# EAGLE design motor_driver2 (EAGLE 6.2)
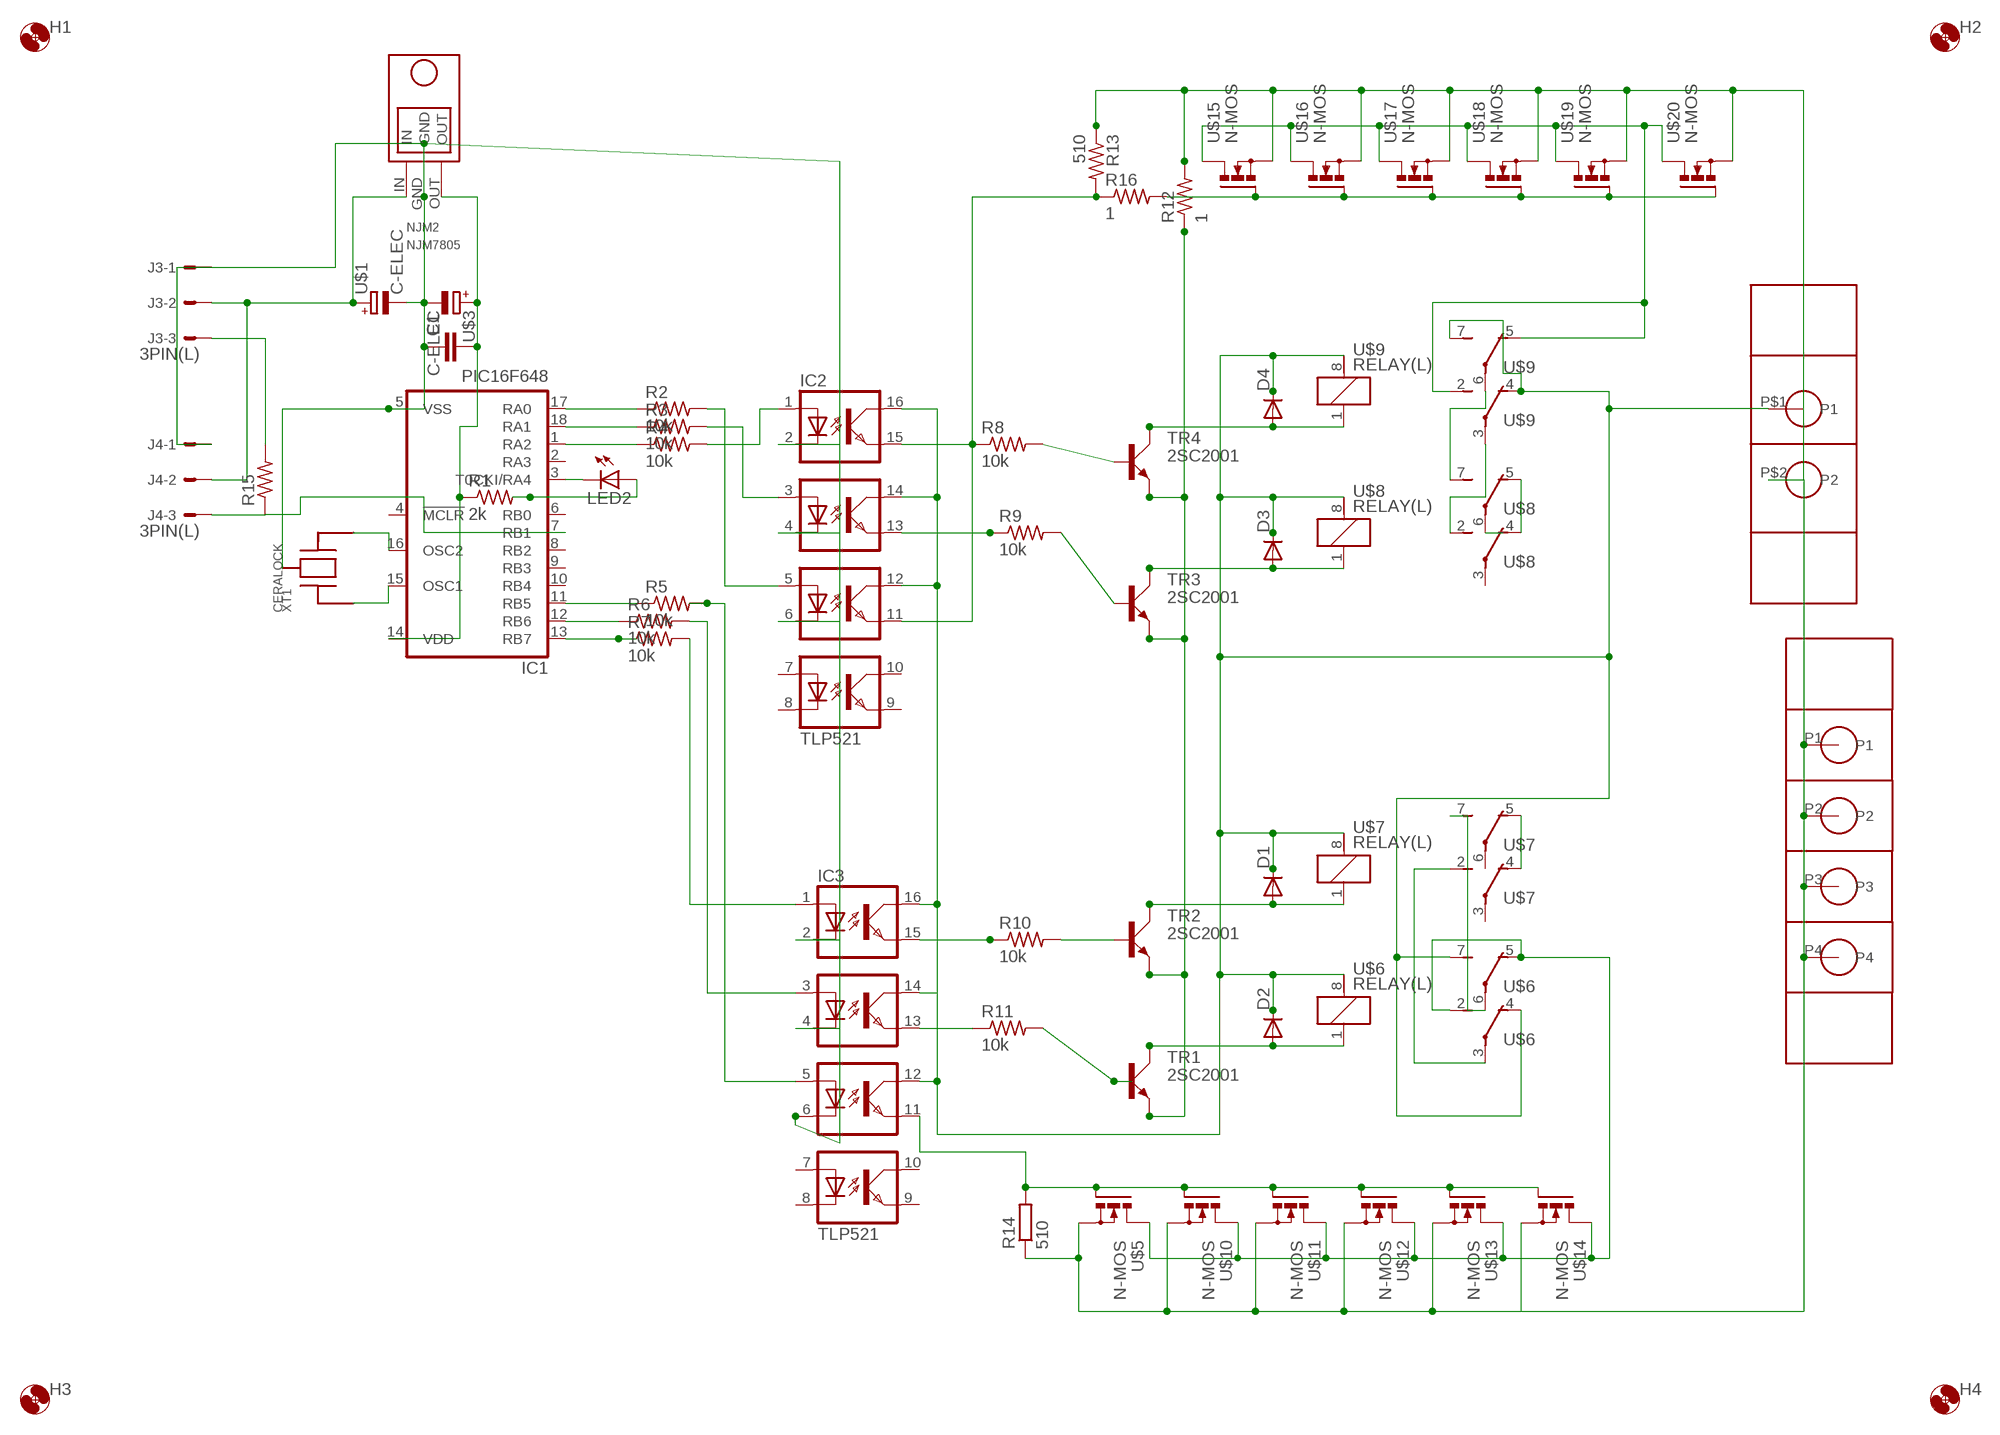
[diagram p0: schematic, sheet 1]

## Parts
C1  C-  [C-2.54]
D1  DIODE7.5  [DIODE7.5]
D2  DIODE7.5  [DIODE7.5]
D3  DIODE7.5  [DIODE7.5]
D4  DIODE7.5  [DIODE7.5]
H1  HOLE3.3M3BOLT  [HOLE3.3]
H2  HOLE3.3M3BOLT  [HOLE3.3]
H3  HOLE3.3M3BOLT  [HOLE3.3]
H4  HOLE3.3M3BOLT  [HOLE3.3]
IC1  PIC16F648  [DIL18]
IC2  TLP521  [DIL16]
IC3  TLP521  [DIL16]
J3  3PIN(L)  [3PL]
J4  3PIN(L)  [3PL]
LED2  LED-2  [LED5MM-2]
NJM2  NJM7805  [NJM7805]
R1  2k  R-  [0207/10]
R2  10k  R-  [0207/10]
R3  10k  R-  [0207/10]
R4  10k  R-  [0207/10]
R5  10k  R-  [0207/10]
R6  10k  R-  [0207/10]
R7  10k  R-  [0207/10]
R8  10k  R-  [0207/10]
R9  10k  R-  [0207/10]
R10  10k  R-  [0207/10]
R11  10k  R-  [0207/10]
R12  1  R-  [0207/10]
R13  510  R-  [0207/10]
R14  510  R-EU2R0207V  [R0207V]
R15  R-  [0207/10]
R16  1  R-  [0207/10]
TR1  2SC2001  [TO92BCE]
TR2  2SC2001  [TO92BCE]
TR3  2SC2001  [TO92BCE]
TR4  2SC2001  [TO92BCE]
U$1  C-ELEC  [C-6MM]
U$2  BP341L  [BP341L]
U$3  C-ELEC  [C-6MM]
U$4  BP341L_1  [BP341L]
U$5  N-MOS  [TO220BV]
U$6  RELAY(L)  [G2R2]
U$7  RELAY(L)  [G2R2]
U$8  RELAY(L)  [G2R2]
U$9  RELAY(L)  [G2R2]
U$10  N-MOS  [TO220BV]
U$11  N-MOS  [TO220BV]
U$12  N-MOS  [TO220BV]
U$13  N-MOS  [TO220BV]
U$14  N-MOS  [TO220BV]
U$15  N-MOS  [TO220BV]
U$16  N-MOS  [TO220BV]
U$17  N-MOS  [TO220BV]
U$18  N-MOS  [TO220BV]
U$19  N-MOS  [TO220BV]
U$20  N-MOS  [TO220BV]
XT1  CERALOCK  [CERALOCK]

## Nets
5V: C1.P$2 IC1.14(VDD) NJM2.OUT R1.1 U$3.+
9V: J3.2 J4.2 NJM2.IN U$1.+
12V: D1.PK(C) D2.PK(C) D3.PK(C) D4.PK(C) IC2.12(COL2) IC2.14(COL1) IC2.16(COL0) IC3.12(COL2) IC3.14(COL1) IC3.16(COL0) U$4.P$1(P1) U$6.4(R2:O) U$6.7(R1:S) U$6.8 U$7.8 U$8.8 U$9.4(R2:O) U$9.7(R1:S) U$9.8
FET_D1: U$9.2(R2:S) U$9.5(R1:O) U$15.D U$16.D U$17.D U$18.D U$19.D U$20.D
FET_G1: IC2.11(EMIT2) R13.2 R16.1
FET_G2: IC3.11(EMIT2) R14.2 U$5.G U$10.G U$11.G U$12.G U$13.G U$14.G
GND1: C1.P$1 IC1.5(VSS) IC2.2(C0) IC2.4(C1) IC2.6(C2) IC3.2(C0) IC3.4(C1) IC3.6(C2) J3.1 J4.1 NJM2.GND U$1.- U$3.- XT1.P2
GND2: R12.2 R13.1 R14.1 U$2.P1 U$2.P2 U$2.P3 U$2.P4 U$4.P$2(P2) U$5.S U$10.S U$11.S U$12.S U$13.S U$14.S U$15.S U$16.S U$17.S U$18.S U$19.S U$20.S
GND3: R12.1 TR1.E TR2.E TR3.E TR4.E
LED_A: LED2.A R1.2
LED_C: IC1.3(T0CKI/RA4) LED2.K(C)
N$1: IC1.16(OSC2) XT1.P3
N$2: J3.3 R15.2
N$3: R16.2 U$15.G U$16.G U$17.G U$18.G U$19.G U$20.G
N$7: IC1.15(OSC1) XT1.P1
N$10: IC1.17(RA0) R2.1
N$11: IC1.18(RA1) R3.1
N$12: IC1.1(RA2) R4.1
N$13: IC1.13(RB7) R7.1
N$14: IC1.12(RB6) R6.1
N$15: IC1.11(RB5) R5.1
N$16: IC2.5(A2) R2.2
N$17: IC2.3(A1) R3.2
N$18: IC2.1(A0) R4.2
N$19: IC3.1(A0) R7.2
N$20: IC3.3(A1) R6.2
N$21: IC3.5(A2) R5.2
N$23: IC2.15(EMIT0) R8.1
N$24: IC2.13(EMIT1) R9.1
N$25: IC3.15(EMIT0) R10.1
N$26: IC3.13(EMIT1) R11.1
N$27: R11.2 TR1.B
N$29: D4.PA(A) TR4.C U$9.1
N$30: D3.PA(A) TR3.C U$8.1
N$31: D1.PA(A) TR2.C U$7.1
N$32: D2.PA(A) TR1.C U$6.1
N$37: U$5.D U$6.2(R2:S) U$6.5(R1:O) U$10.D U$11.D U$12.D U$13.D U$14.D
N$40: U$8.7(R1:S) U$9.6(R1:P)
N$41: U$8.2(R2:S) U$9.3(R2:P)
N$42: U$8.4(R2:O) U$8.5(R1:O)
N$43: R8.2 TR4.B
N$44: R9.2 TR3.B
N$45: R10.2 TR2.B
N$47: U$8.6(R1:P)
N$50: U$6.6(R1:P) U$7.7(R1:S)
N$51: U$6.3(R2:P) U$7.2(R2:S)
N$53: U$7.4(R2:O) U$7.5(R1:O)
SIGNAL: IC1.7(RB1) J4.3 R15.1
Unconnected: IC1.2(RA3) IC1.4(!MCLR) IC1.6(RB0) IC1.8(RB2) IC1.9(RB3) IC1.10(RB4) IC2.7(A3) IC2.8(C3) IC2.9(EMIT3) IC2.10(COL3) IC3.7(A3) IC3.8(C3) IC3.9(EMIT3) IC3.10(COL3) U$7.3(R2:P) U$7.6(R1:P) U$8.3(R2:P)

## Library data of the parts
C1 = My_rcl:C-
D1-D4 = diode:DIODE7.5
H1-H4 = FP-21T for MITS:HOLE3.3
IC1 = FP-21T for MITS:PIC16F648
IC2 IC3 = FP-21T for MITS:TLP521
J3 J4 = my_connector:3PIN(L)
LED2 = my_led:LED-2
NJM2 = My_NJM7805:NJM7805
R1-R13 R15 R16 = My_rcl:R-: Resistor
R14 = FP-21T for MITS:R-EU2
TR1-TR4 = My_transistor:2SC2001: NPN Transistor
U$1 U$3 = My_rcl:C-ELEC
U$2 = BP341_4PIN:BP341L
U$4 = BP341L_1:BP341L_1
U$5 U$10-U$20 = FET_kai:N-MOS
U$6-U$9 = relay:RELAY(L)
XT1 = ceralock:CERALOCK

## Board
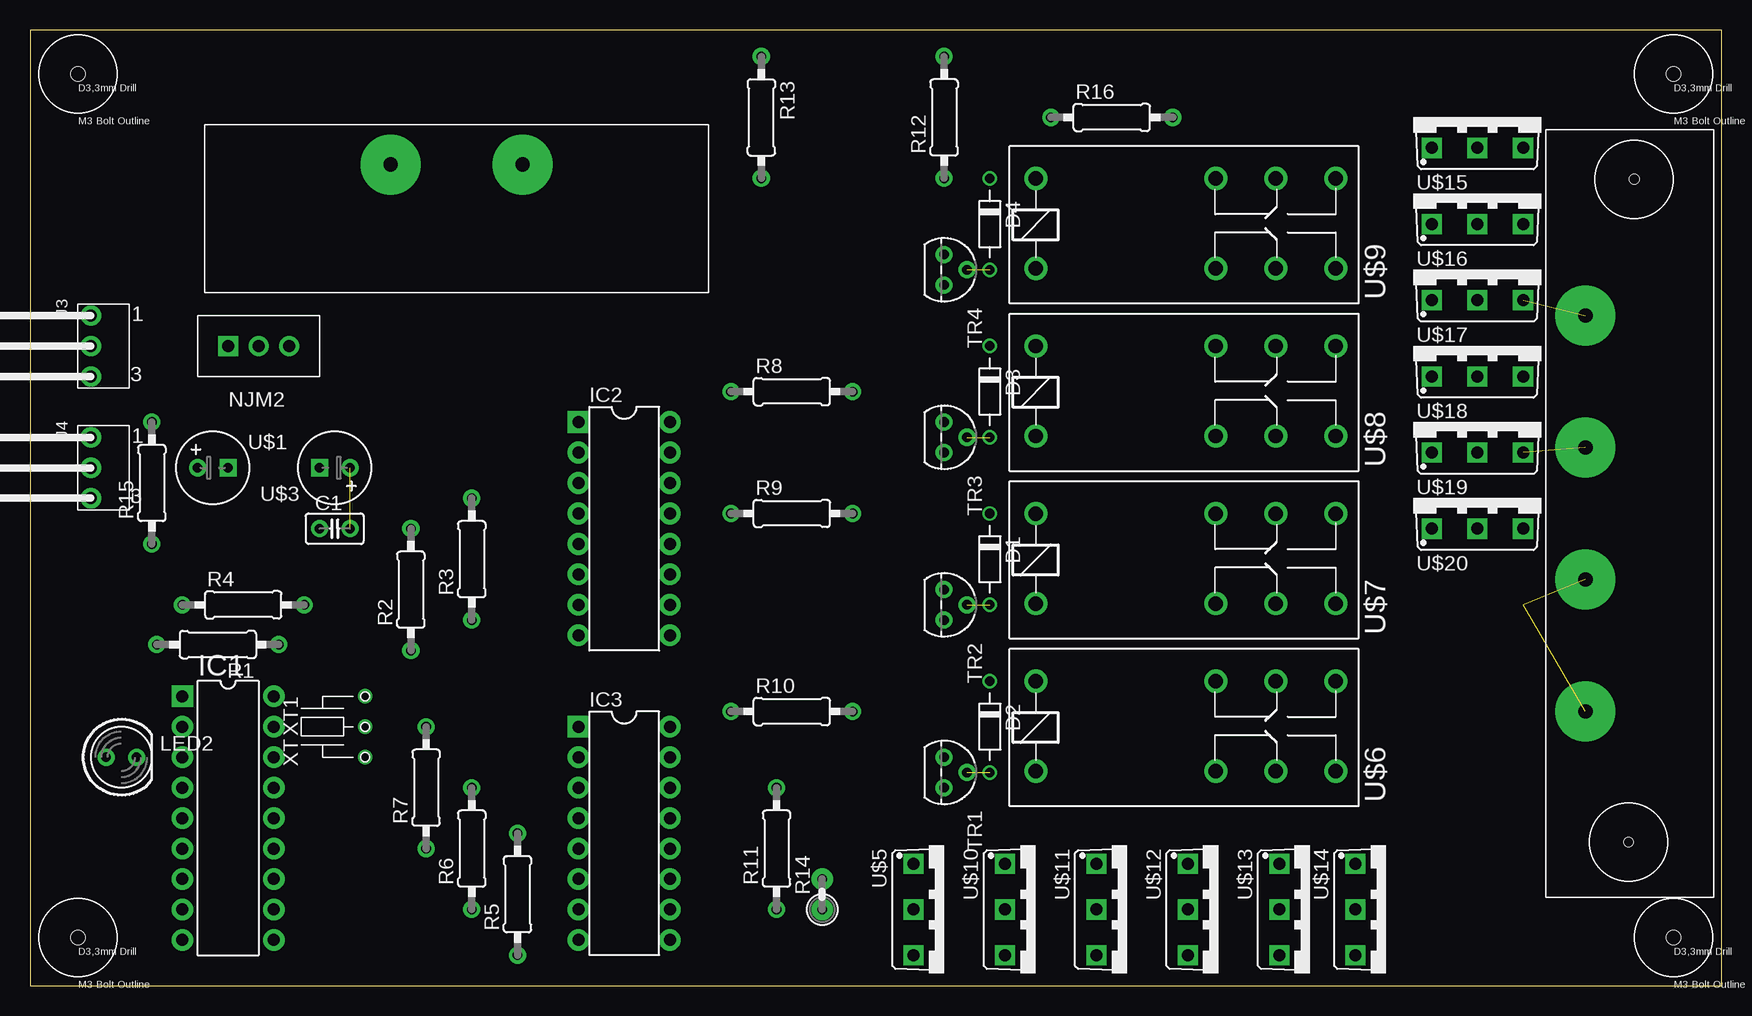
[diagram p1: board, top side]
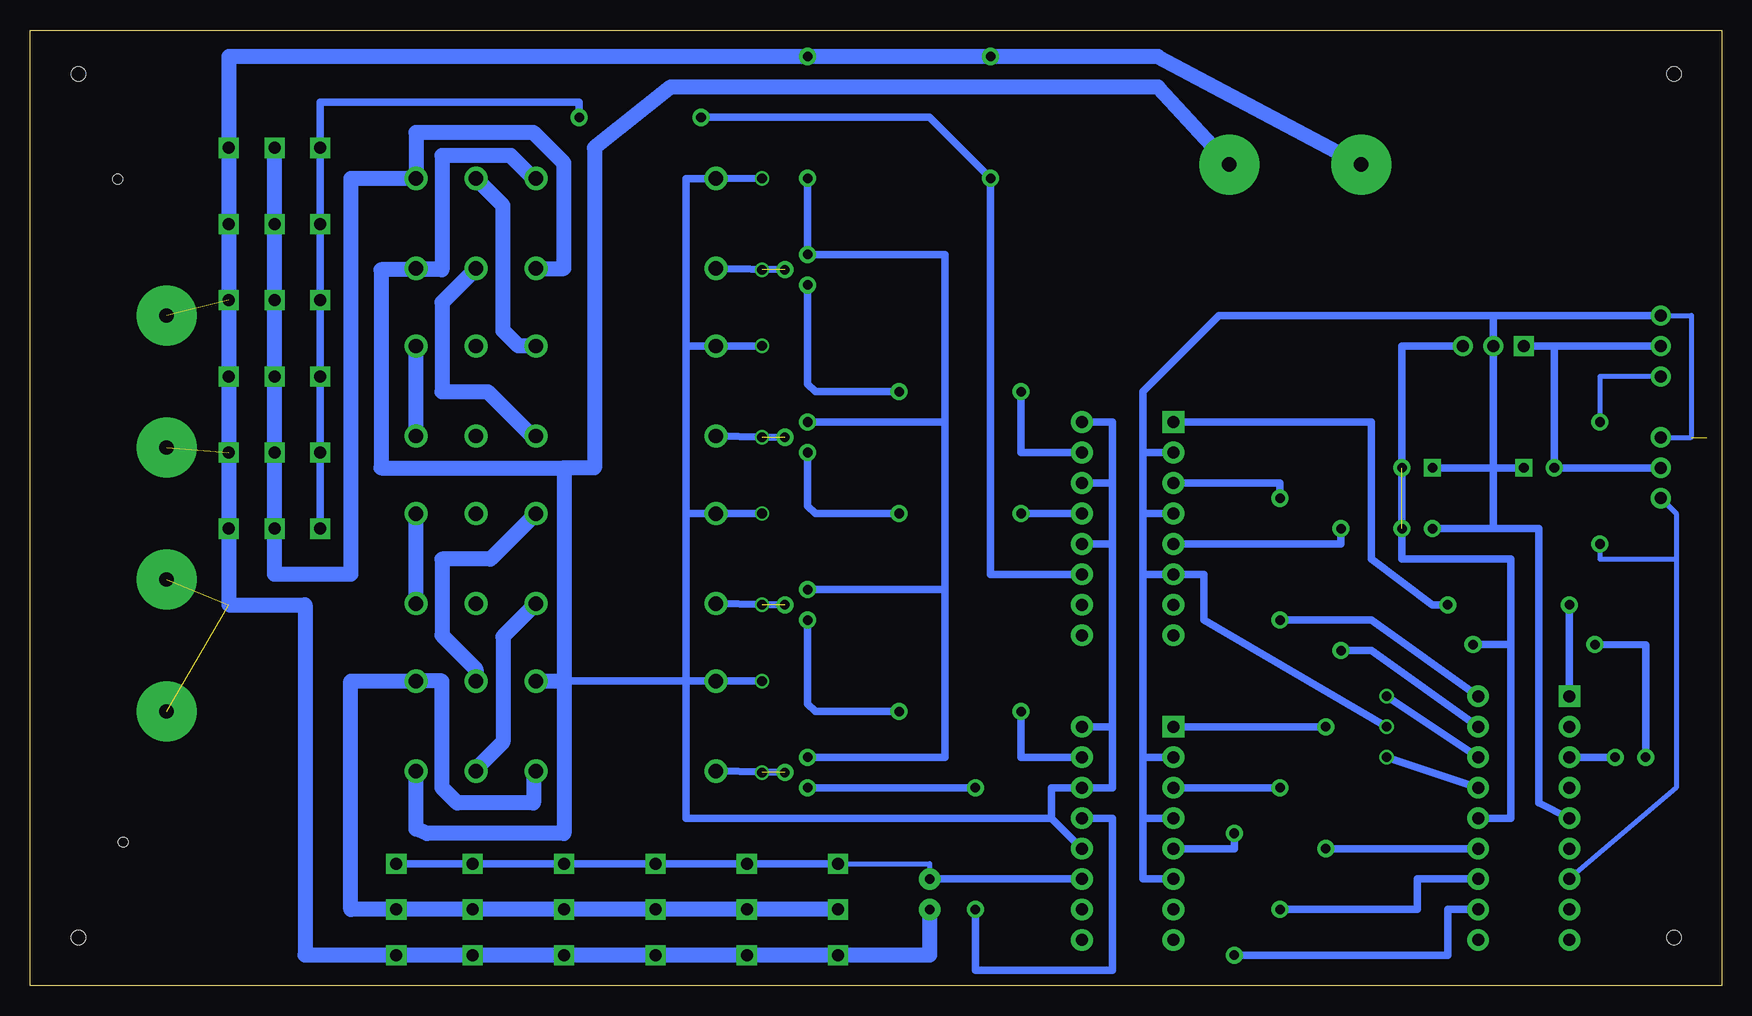
[diagram p2: board, bottom side, seen from below]

Size 141.03 x 79.68 mm. Coordinates in mm from the lower left corner, seen from the top.
Outline: 0,0 141.03,0 141.03,79.68 0,79.68 0,0
Copper layers (1*16): Top 0.035mm / dielectric 1.5mm / Bottom 0.035mm
Design rules: minimum track width 0.15mm, minimum drill 0.3mm, track to track 0.15mm, track to pad 0.15mm, pad to pad 0.15mm, via to via 0.15mm, smd to smd 0.15mm, copper to edge 0.7mm, drill to drill 0.45mm, minimum pad ring 0.15mm, minimum via ring 0.15mm, stop-mask expansion 4mil, vias tented up to drill 0mil, thermal gap 0.15mm

### Footprints (pad centres in the part's own frame; a part is rotated, then mirrored left to right if it is on the bottom)
C-2.54 = drill 0.8 pad 1.422: P$1 -1.27,0; P$2 1.27,0
DIODE7.5 = drill 0.8: PA 3.81,0; PK -3.81,0
HOLE3.3 = hole 1.2: 0,0
DIL18 = drill 1 pad 1.8 square: 1 -10.16,-3.81 | drill 1 pad 1.8: 2 -7.62,-3.81; 3 -5.08,-3.81; 4 -2.54,-3.81; 5 0,-3.81; 6 2.54,-3.81; 7 5.08,-3.81; 8 7.62,-3.81; 9 10.16,-3.81; 10 10.16,3.81; 11 7.62,3.81; 12 5.08,3.81; 13 2.54,3.81; 14 0,3.81; 15 -2.54,3.81; 16 -5.08,3.81; 17 -7.62,3.81; 18 -10.16,3.81
DIL16 = drill 1 pad 1.8 square: 1 -8.89,-3.81 | drill 1 pad 1.8: 2 -6.35,-3.81; 3 -3.81,-3.81; 4 -1.27,-3.81; 5 1.27,-3.81; 6 3.81,-3.81; 7 6.35,-3.81; 8 8.89,-3.81; 9 8.89,3.81; 10 6.35,3.81; 11 3.81,3.81; 12 1.27,3.81; 13 -1.27,3.81; 14 -3.81,3.81; 15 -6.35,3.81; 16 -8.89,3.81
3PL = drill 1 pad 1.676: 1 2.54,3.81; 2 0,3.81; 3 -2.54,3.81
LED5MM-2 = drill 0.8 pad 1.422: A -1.27,0; K 1.27,0
NJM7805 = drill 1 pad 1.676: GND 0,0; OUT 2.54,0 | drill 1 pad 1.676 square: IN -2.54,0
0207/10 = drill 0.8 pad 1.422: 1 -5.08,0; 2 5.08,0
R0207V = drill 0.8 pad 1.778: 1 -1.27,0; 2 1.27,0
TO92BCE = drill 0.8 pad 1.422: B 1.27,0; C 0,1.905; E -1.27,0
C-6MM = drill 0.8 pad 1.422: + -1.27,0 | drill 0.8 pad 1.422 square: - 1.27,0
BP341L = drill 1.2 pad 5: P1 -16.5,-3.7; P2 -5.5,-3.7; P3 5.5,-3.7; P4 16.5,-3.7 | hole 0.8: -27.87,0.37; 27.4,-0.1
BP341L' = drill 1.2 pad 5: P$1 -5.499,-3.698; P$2 5.499,-3.698
TO220BV = drill 1 pad 1.676 square: D 0,0; G -3.81,0; S 3.81,0
G2R2 = drill 1.2 pad 1.93: 1 -11.4,-3.7; 2 3.6,-3.7; 3 8.6,-3.7; 4 13.6,-3.7; 5 13.6,3.8; 6 8.6,3.8; 7 3.6,3.8; 8 -11.4,3.8
CERALOCK = drill 0.8: P1 -2.54,-3.81; P2 0,-3.81; P3 2.54,-3.81

### Placement (x,y rotation side)
C1  25.4,38.1 0 top
D1  80.01,35.56 270 top
D2  80.01,21.59 270 top
D3  80.01,49.53 270 top
D4  80.01,63.5 270 top
H1  137,4 0 top
H2  4,76 0 top
H3  4,4 0 top
H4  137,76 0 top
IC1  16.51,13.97 270 top
IC2  49.53,38.1 270 top
IC3  49.53,12.7 270 top
J3  8.89,53.34 90 top
J4  8.89,43.18 90 top
LED2  7.62,19.05 0 top
NJM2  19.05,53.34 0 top
R1  15.66,28.44 180 top
R2  31.75,33.02 90 top
R3  36.83,35.56 90 top
R4  17.78,31.75 0 top
R5  40.64,7.62 90 top
R6  36.83,11.43 90 top
R7  33.02,16.51 90 top
R8  63.5,49.53 0 top
R9  63.5,39.37 0 top
R10  63.5,22.86 0 top
R11  62.23,11.43 90 top
R12  76.2,72.39 90 top
R13  60.96,72.39 270 top
R14  66.04,7.62 90 top
R15  10.16,41.91 90 top
R16  90.17,72.39 0 top
TR1  76.2,17.78 270 top
TR2  76.2,31.75 270 top
TR3  76.2,45.72 270 top
TR4  76.2,59.69 270 top
U$1  15.24,43.18 0 top
U$2  133.35,39.37 270 top
U$3  25.4,43.18 180 top
U$4  BP341L_1  [BP341L']  35.56,64.77 180 top
U$5  73.66,6.35 270 top
U$6  95.25,21.59 0 top
U$7  95.25,35.56 0 top
U$8  95.25,49.53 0 top
U$9  95.25,63.5 0 top
U$10  81.28,6.35 270 top
U$11  88.9,6.35 270 top
U$12  96.52,6.35 270 top
U$13  104.14,6.35 270 top
U$14  110.49,6.35 270 top
U$15  120.65,69.85 0 top
U$16  120.65,63.5 0 top
U$17  120.65,57.15 0 top
U$18  120.65,50.8 0 top
U$19  120.65,44.45 0 top
U$20  120.65,38.1 0 top
XT1  24.13,21.59 90 top

### Tracks (layer width: path | path; a pad name or v marks a point on that pad's centre or on a via)
5V  (1 unrouted)
  Bottom 0.61: NJM2.OUT 26.67,53.34 C1.P$2 26.67,35.56 17.68,35.56 17.61,35.56 | 17.61,35.56 17.58,33.84 17.58,13.97 IC1.14 | R1.1 17.61,28.44 17.61,35.56
9V
  Bottom 0.61: J3.2 13.97,53.34 | 13.97,53.34 U$1.+ J4.2 | 13.97,53.34 NJM2.IN
12V
  Bottom 0.61: D4.PK U$9.8 86.36,67.3 86.36,53.34 U$8.8 | U$8.8 D3.PK | U$7.8 D1.PK | IC2.16 50.8,46.99 50.8,41.91 | IC2.14 50.8,41.91 | 50.8,41.91 50.8,36.83 | IC2.12 50.8,36.83 | 50.8,36.83 50.8,21.59 | 50.8,21.59 50.8,16.51 IC3.14 55.88,16.51 55.88,13.97 | IC3.16 50.8,21.59 | IC3.12 55.88,13.97 | U$8.8 86.36,53.33 86.36,39.37 U$7.8 | U$7.8 86.36,39.36 86.36,25.4 | 86.36,25.4 U$6.8 | U$6.8 D2.PK U$6.8 | 86.36,25.4 96.52,25.4 | 86.36,25.4 86.36,13.97 55.88,13.97
  Bottom 1.016: U$6.7 arc90 U$6.7
  Bottom 1.27: 106.68,59.8 106.68,69.22 100.97,69.22 99.05,67.3 U$9.7 | U$9.4 106.68,59.8 | 106.68,59.8 106.68,59.69 111.76,59.69 111.76,43.18 96.52,43.18 | 96.52,43.18 96.52,25.4 | U$6.7 96.52,25.4 | 96.52,25.4 96.52,12.7 107.95,12.7 108.85,13.07 U$6.4 | 96.52,43.18 93.98,43.18 93.98,69.85 87.63,74.93 46.99,74.93 U$4.P$1
FET_D1
  Bottom 1.27: U$9.2 96.52,59.8 96.52,68.58 99.06,71.12 108.85,71.12 U$9.5 114.3,67.3 114.3,34.29 120.65,34.29 U$20.D U$19.D U$18.D U$17.D U$16.D U$15.D
FET_G1
  Bottom 0.61: IC2.11 60.96,34.29 R13.2 66.04,72.39 R16.1
FET_G2
  Bottom 0.406: U$5.G 66.04,10.16 R14.2
  Bottom 0.61: IC3.11 R14.2 | U$5.G U$10.G U$11.G U$12.G U$13.G | 105.41,10.16 U$13.G | U$13.G U$14.G
GND1  (1 unrouted)
  Bottom 0.406: J4.1 2.54,45.72 2.54,55.88 J3.1
  Bottom 0.61: 19.05,43.18 NJM2.GND 19.05,55.88 | 19.05,43.18 U$1.- | U$3.- 19.05,43.18 | 19.05,43.18 19.05,38.1 | 19.05,38.1 C1.P$1 | 19.05,38.1 15.24,38.1 15.24,15.24 IC1.5 | 48.26,44.45 48.26,49.53 41.91,55.88 19.05,55.88 | 48.26,13.97 48.26,8.89 IC3.6 | 48.26,13.97 48.26,19.05 | 48.26,19.05 48.26,34.29 | 48.26,34.29 48.26,39.37 | 48.26,39.37 48.26,44.45 | IC2.2 48.26,44.45 | 48.26,34.29 IC2.6 43.18,34.29 43.18,30.48 XT1.P2 | IC2.4 48.26,39.37 | IC3.4 48.26,13.97 | IC3.2 48.26,19.05 | J3.1 19.05,55.88
GND2  (4 unrouted)
  Bottom 1.27: R14.1 66.04,2.54 U$5.S U$10.S | U$10.S U$11.S | U$11.S U$12.S U$13.S U$14.S 118.11,2.54 118.11,31.75 124.46,31.75 U$20.S U$19.S U$18.S U$17.S U$16.S U$15.S 124.46,77.47 R12.2 R13.1 46.99,77.47 U$4.P$2 | U$10.S U$11.S
GND3
  Bottom 0.61: R12.1 TR4.E 64.77,60.96 64.77,46.99 | 64.77,46.99 64.77,33.02 | 64.77,33.02 64.77,19.05 TR1.E | TR2.E 64.77,33.02 | TR3.E 64.77,46.99
LED_A
  Bottom 0.61: R1.2 6.35,28.42 LED2.A
LED_C
  Bottom 0.61: LED2.K IC1.3
N$1
  Bottom 0.61: IC1.16 XT1.P3
N$2
  Bottom 0.406: J3.3 10.16,50.8 R15.2
N$3
  Bottom 0.61: U$20.G U$19.G U$18.G U$17.G U$16.G U$15.G 116.84,73.66 95.25,73.66 R16.2
N$7
  Bottom 0.61: XT1.P1 IC1.15
N$10
  Bottom 0.61: IC1.17 29.21,27.94 R2.1
N$11
  Bottom 0.61: IC1.18 29.21,30.48 R3.1
N$12
  Bottom 0.61: IC1.1 R4.1
N$13
  Bottom 0.61: IC1.13 R7.1
N$14
  Bottom 0.61: IC1.12 25.4,8.89 25.4,6.35 R6.1
N$15
  Bottom 0.61: IC1.11 22.86,6.35 22.86,2.54 R5.1
N$16
  Bottom 0.61: R2.2 31.75,36.83 IC2.5
N$17
  Bottom 0.61: R3.2 36.83,41.91 IC2.3
N$18
  Bottom 0.61: R4.2 24.13,31.75 29.21,35.56 29.21,46.99 IC2.1
N$19
  Bottom 0.61: R7.2 IC3.1
N$20
  Bottom 0.61: R6.2 IC3.3
N$21
  Bottom 0.61: R5.2 40.64,11.43 IC3.5
N$23
  Bottom 0.61: IC2.15 58.42,44.45 R8.1
N$24
  Bottom 0.61: IC2.13 R9.1
N$25
  Bottom 0.61: IC3.15 58.42,19.05 R10.1
N$26
  Bottom 0.61: IC3.13 50.8,13.97 50.8,1.27 62.23,1.27 R11.1
N$27
  Bottom 0.61: R11.2 TR1.B
N$29  (1 unrouted)
  Bottom 0.61: TR4.C U$9.1
N$30  (1 unrouted)
  Bottom 0.61: TR3.C U$8.1
N$31  (1 unrouted)
  Bottom 0.61: TR2.C U$7.1
N$32  (1 unrouted)
  Bottom 0.61: TR1.C U$6.1
N$37
  Bottom 1.016: U$6.5 | U$14.D 111.76,6.35
  Bottom 1.27: U$5.D U$10.D U$11.D U$12.D U$13.D | U$13.D U$14.D | U$6.2 99.06,17.68 99.06,15.24 105.41,15.24 106.68,16.51 106.68,25.4 106.69,25.39 U$6.5 114.29,25.39 114.3,25.4 114.3,6.35 U$13.D
N$40
  Bottom 1.27: U$8.7 100.32,53.33 101.6,54.61 101.6,65.05 U$9.6 103.85,67.28
N$41
  Bottom 1.27: U$9.3 106.68,56.97 106.68,49.53 102.87,49.53 99.17,45.83 U$8.2
N$42
  Bottom 1.27: U$8.4 U$8.5
N$43
  Bottom 0.61: R8.2 75.56,49.53 76.2,50.16 TR4.B
N$44
  Bottom 0.61: R9.2 75.56,39.37 76.2,40.01 TR3.B
N$45
  Bottom 0.61: R10.2 75.56,22.86 76.2,23.5 TR2.B
N$50
  Bottom 1.27: U$7.7 102.65,35.56 106.68,35.56 106.68,29.21 103.85,26.38 U$6.6
N$51
  Bottom 1.27: U$7.2 101.6,29.11 101.6,20.32 103.85,18.07 U$6.3
N$53
  Bottom 1.27: U$7.4 U$7.5
SIGNAL
  Bottom 0.406: R15.1 10.16,35.56 5.08,35.56 3.81,35.56 | 3.81,35.56 3.81,16.51 IC1.7 | J4.3 3.81,39.37 3.81,35.56